# EAGLE design HS(MASTER SHIELD MAX485)V1 (EAGLE 8.3.0)
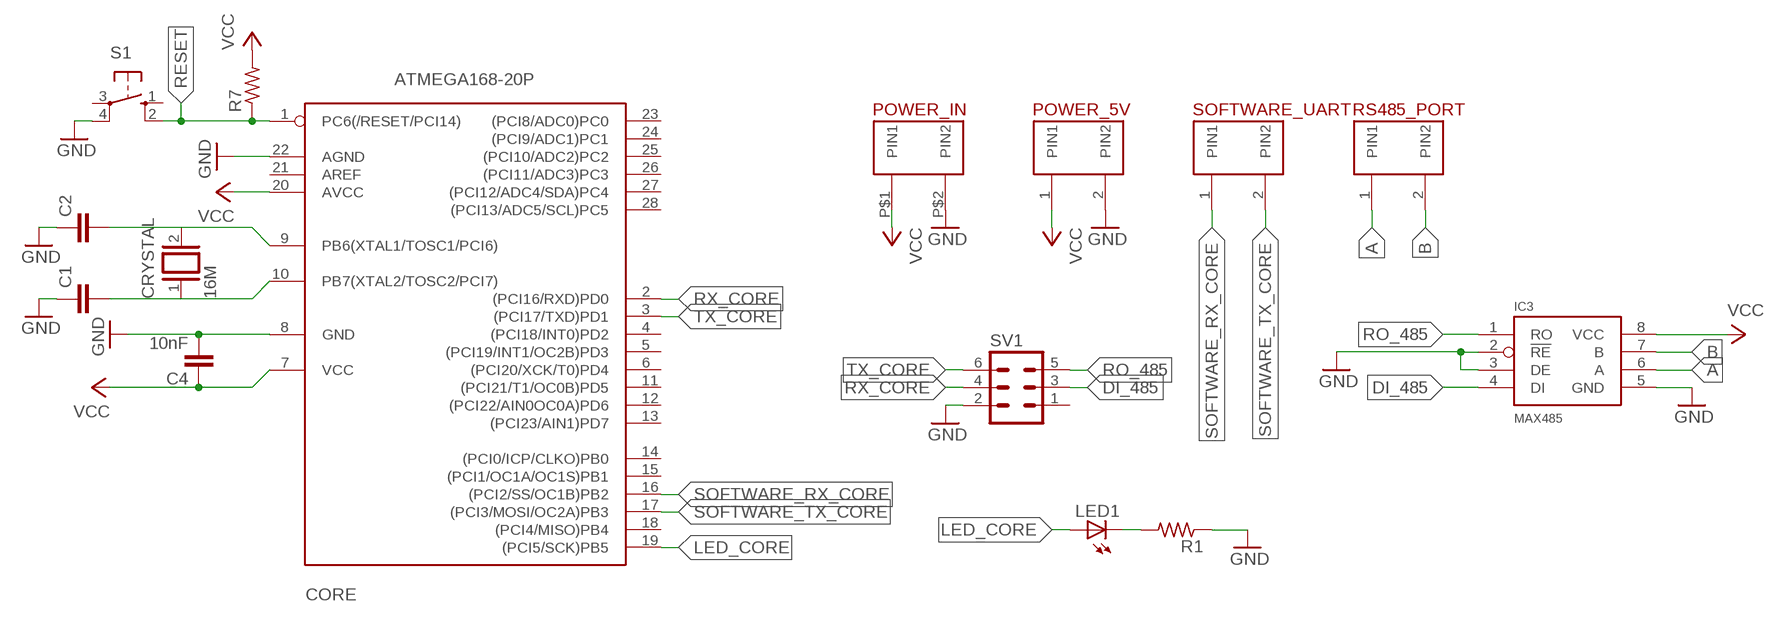
[diagram p0: schematic, sheet 1]

## Parts
C1  C-EU025-024X044  [C025-024X044]
C2  C-EU025-024X044  [C025-024X044]
C4  10nF  C5/2.5  [C5B2.5]
CORE  ATMEGA168-20P  [DIL28-3]
CRYSTAL  16M  XTAL/S  [QS]
IC3  MAX485  [DIP8]
LED1  LED3MM  [LED3MM]
POWER_5V  7325  [2.54MM]
POWER_IN  4396  [4MM]
R1  R-US_0207/10  [0207/10]
R7  R-US_0207/10  [0207/10]
RS485_PORT  7325  [2.54MM]
S1  10-XX  [B3F-10XX]
SOFTWARE_UART  7325  [2.54MM]
SV1  MA03-2  [MA03-2]

## Nets
A: IC3.6(A) RS485_PORT.1(PIN1)
B: IC3.7(B) RS485_PORT.2(PIN2)
DI_485: IC3.4(DI) SV1.3
GND: C1.1 C2.1 C4.2 CORE.8(GND) CORE.22(AGND) IC3.2(!RE) IC3.3(DE) IC3.5(GND) POWER_5V.2(PIN2) POWER_IN.P$2(PIN2) R1.1 S1.4(P1) SV1.2
LED_CORE: CORE.19((PCI5/SCK)PB5) LED1.A
N$1: C2.2 CORE.9(PB6(XTAL1/TOSC1/PCI6)) CRYSTAL.2
N$2: C1.2 CORE.10(PB7(XTAL2/TOSC2/PCI7)) CRYSTAL.1
N$3: LED1.K(C) R1.2
RESET: CORE.1(PC6(/RESET/PCI14)) R7.1 S1.2(S1)
RO_485: IC3.1(RO) SV1.5
RX_CORE: CORE.2((PCI16/RXD)PD0) SV1.4
SOFTWARE_RX_CORE: CORE.16((PCI2/SS/OC1B)PB2) SOFTWARE_UART.1(PIN1)
SOFTWARE_TX_CORE: CORE.17((PCI3/MOSI/OC2A)PB3) SOFTWARE_UART.2(PIN2)
TX_CORE: CORE.3((PCI17/TXD)PD1) SV1.6
VCC: C4.1 CORE.7(VCC) CORE.20(AVCC) IC3.8(VCC) POWER_5V.1(PIN1) POWER_IN.P$1(PIN1) R7.2
Unconnected: CORE.4((PCI18/INT0)PD2) CORE.5((PCI19/INT1/OC2B)PD3) CORE.6((PCI20/XCK/T0)PD4) CORE.11((PCI21/T1/OC0B)PD5) CORE.12((PCI22/AIN0OC0A)PD6) CORE.13((PCI23/AIN1)PD7) CORE.14((PCI0/ICP/CLKO)PB0) CORE.15((PCI1/OC1A/OC1S)PB1) CORE.18((PCI4/MISO)PB4) CORE.21(AREF) CORE.23((PCI8/ADC0)PC0) CORE.24((PCI9/ADC1)PC1) CORE.25((PCI10/ADC2)PC2) CORE.26((PCI11/ADC3)PC3) CORE.27((PCI12/ADC4/SDA)PC4) CORE.28((PCI13/ADC5/SCL)PC5) S1.1(S) S1.3(P) SV1.1

## Library data of the parts
C1 C2 = resistor:C-EU: CAPACITOR, European symbol
C4 = capacitor-wima:C: CAPACITOR naming: grid - package width
CORE = adafruit:ATMEGA168*P: MICROCONTROLLER 16 kBytes FLASH 1 kBytes SRAM 512 Bytes EEPROM USART 8-channel 10 bit ADC
CRYSTAL = special:XTAL/S: CRYSTAL
IC3 = max485:MAX485
LED1 = adafruit:LED: LED OSRAM: - CHIPLED LG R971, LG N971, LY N971, LG Q971, LY Q971, LO R971, LY R971 LH N974, LH R974 LS Q976, LO Q976, LY Q976 LO Q996 - Hyper CHIPLED LW Q18S LB Q993, LB Q99A, LB R99A - SideLED LS A670, LO A670, LY A670, LG A670, LP A670 LB A673, LV A673, LT A673, LW A673 LH A674 LY A675 LS A676, LA A676, LO A676, LY A676, LW A676 LS A679, LY A679, LG A679 - Hyper Micro SIDELED® LS Y876, LA Y876, LO Y876, LY Y876 LT Y87S - SmartLED LW L88C, LW L88S LB L89C, LB L89S, LG L890 LS L89K, LO L89K, LY L89K LS L896, LA L896, LO L896, LY L896 - TOPLED LS T670, LO T670, LY T670, LG T670, LP T670 LSG T670, LSP T670, LSY T670, LOP T670, LYG T670 LG T671, LOG T671, LSG T671 LB T673, LV T673, LT T673, LW T673 LH T674 LS T676, LA T676, LO T676, LY T676, LB T676, LH T676, LSB T676, LW T676 LB T67C, LV T67C, LT T67C, LS T67K, LO T67K, LY T67K, LW E67C LS E67B, LA E67B, LO E67B, LY E67B, LB E67C, LV E67C, LT E67C LW T67C LS T679, LY T679, LG T679 LS T770, LO T770, LY T770, LG T770, LP T770 LB T773, LV T773, LT T773, LW T773 LH T774 LS E675, LA E675, LY E675, LS T675 LS T776, LA T776, LO T776, LY T776, LB T776 LHGB T686 LT T68C, LB T68C - Hyper Mini TOPLED® LB M676 - Mini TOPLED Santana® LG M470 LS M47K, LO M47K, LY M47K Source: http://www.osram.convergy.de/
POWER_5V RS485_PORT SOFTWARE_UART = sonchai:7325
POWER_IN = sonchai:4396
R1 R7 = adafruit:R-US_: RESISTOR, American symbol
S1 = switch-omron:10-XX: OMRON SWITCH; MPN: B3F-1000; OC_FARNELL: 176432; OC_NEWARK: 36M3542
SV1 = con-lstb:MA03-2: PIN HEADER; OC_FARNELL: unknown; OC_NEWARK: unknown

## Net classes
0 default: width 0.15 mm, drill 0.3 mm, clearance 0.15 mm

## Board
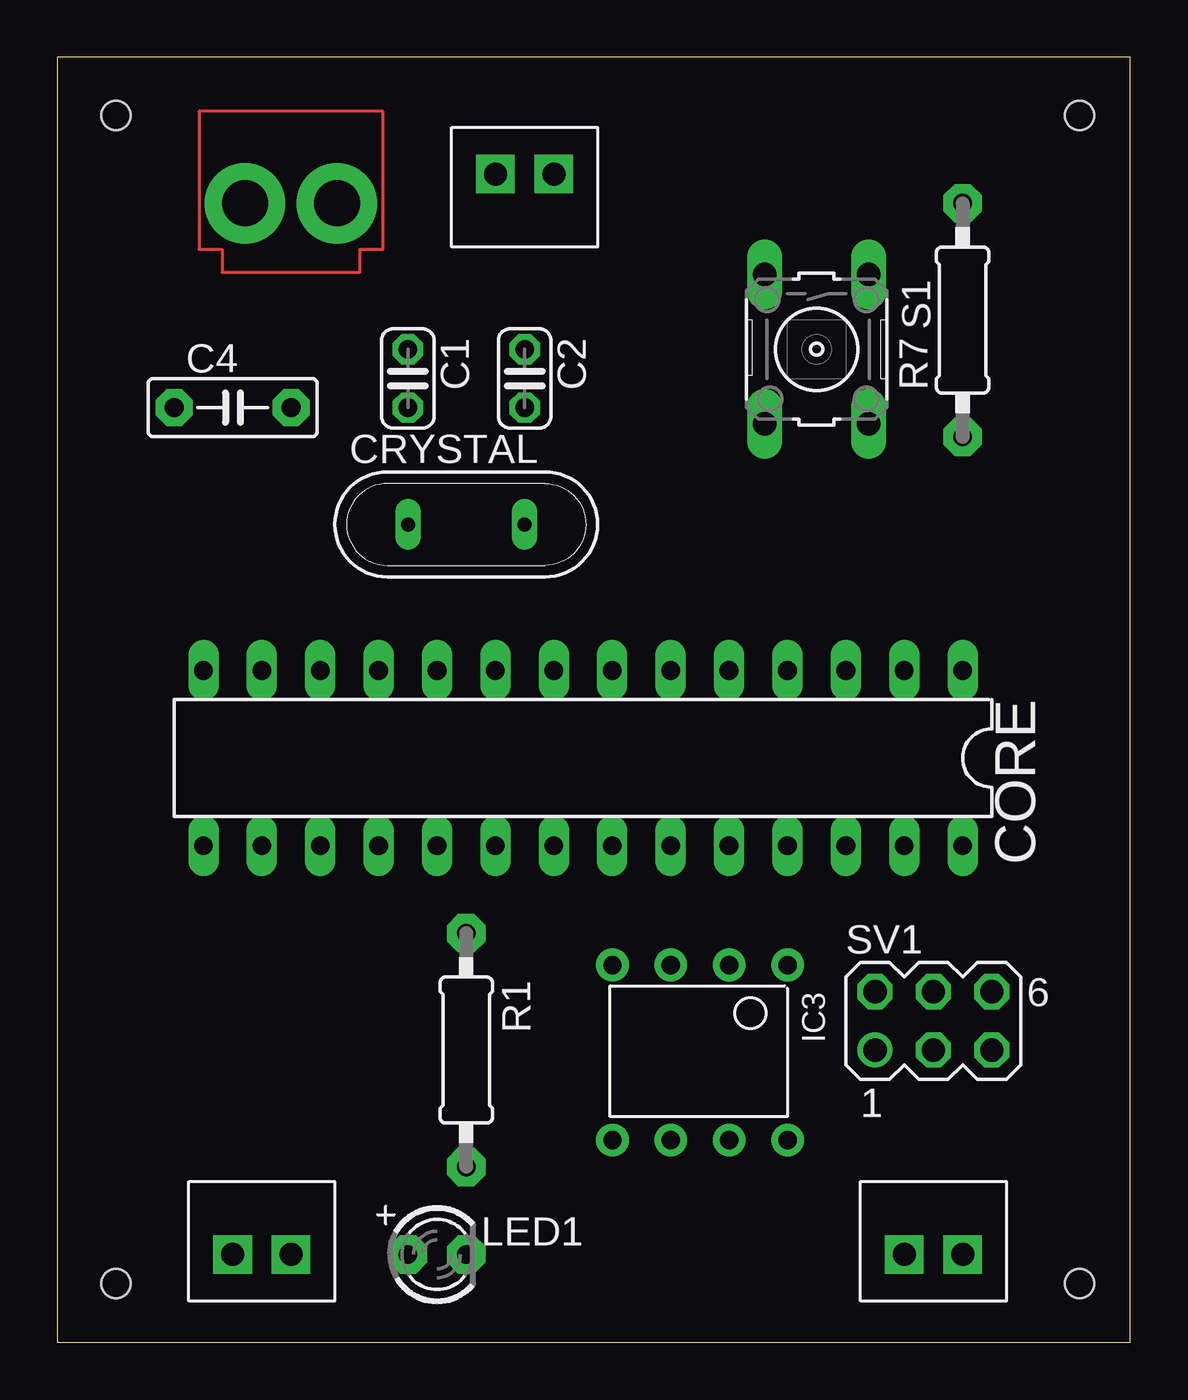
[diagram p1: board, top side]
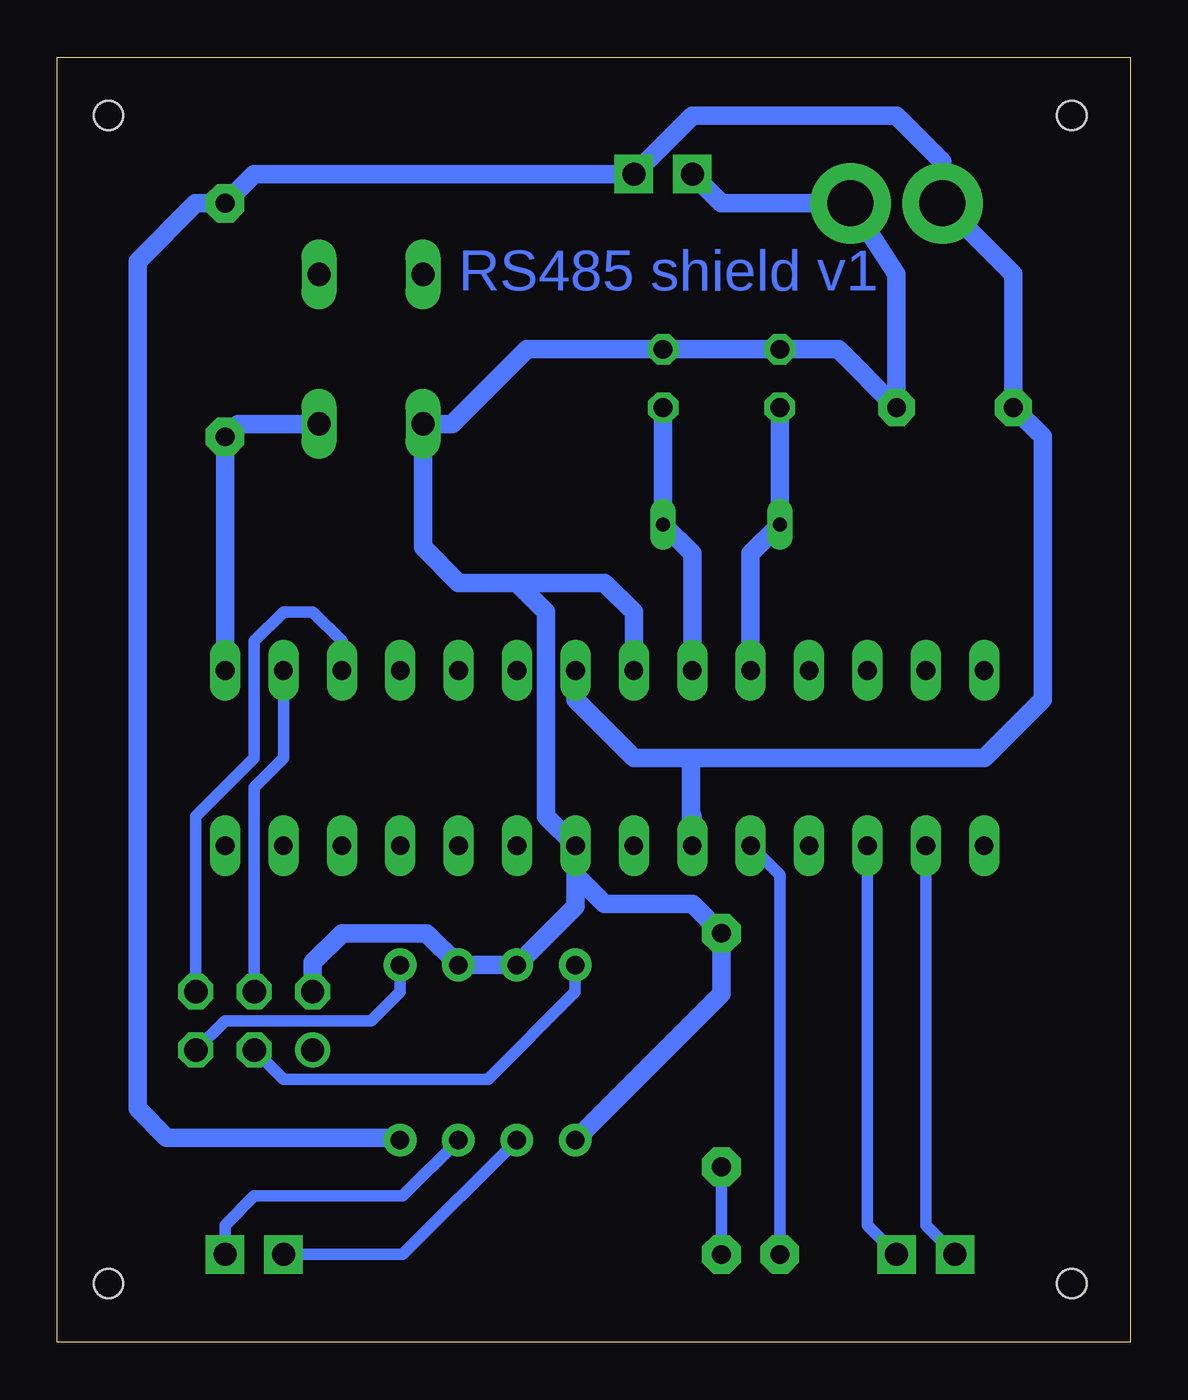
[diagram p2: board, bottom side, seen from below]

Size 46.66 x 55.87 mm. Coordinates in mm from the lower left corner, seen from the top.
Outline: 0,0 46.66,0 46.66,55.87 0,55.87 0,0
Copper layers (1*16): Top 0.035mm / dielectric 1.5mm / Bottom 0.035mm
Design rules "default": minimum track width 6mil, minimum drill 0.35mm, track to track 6mil, track to pad 6mil, pad to pad 6mil, via to via 6mil, smd to smd 6mil, copper to edge 40mil, drill to drill 6mil, minimum pad ring 10mil, minimum via ring 8mil, stop-mask expansion 4mil, vias tented up to drill 0mil, thermal gap 10mil
Holes 1.27 mm at 2.54,53.34 44.45,53.34 44.45,2.54 2.54,2.54

### Footprints (pad centres in the part's own frame; a part is rotated, then mirrored left to right if it is on the bottom)
C025-024X044 = drill 0.813 octagon: 1 -1.27,0; 2 1.27,0
C5B2.5 = drill 0.813 pad 1.6 octagon: 1 -2.54,0; 2 2.54,0
DIL28-3 = drill 0.813 long: 1 -16.51,-3.81; 2 -13.97,-3.81; 3 -11.43,-3.81; 4 -8.89,-3.81; 5 -6.35,-3.81; 6 -3.81,-3.81; 7 -1.27,-3.81; 8 1.27,-3.81; 9 3.81,-3.81; 10 6.35,-3.81; 11 8.89,-3.81; 12 11.43,-3.81; 13 13.97,-3.81; 14 16.51,-3.81; 15 16.51,3.81; 16 13.97,3.81; 17 11.43,3.81; 18 8.89,3.81; 19 6.35,3.81; 20 3.81,3.81; 21 1.27,3.81; 22 -1.27,3.81; 23 -3.81,3.81; 24 -6.35,3.81; 25 -8.89,3.81; 26 -11.43,3.81; 27 -13.97,3.81; 28 -16.51,3.81
QS = drill 0.61 long: 1 -2.54,0; 2 2.54,0
DIP8 = drill 0.8 pad 1.422: 1 -3.7,3.82; 2 -3.7,1.28; 3 -3.7,-1.26; 4 -3.7,-3.8; 5 3.92,-3.8; 6 3.92,-1.26; 7 3.92,1.28; 8 3.92,3.82
LED3MM = drill 0.813 pad 1.676 octagon: A -1.27,0; K 1.27,0
2.54MM = drill 1 pad 1.676 square: 1 -1.27,0; 2 1.27,0
4MM = drill 2 pad 3.5: P$1 -2,0; P$2 2,0
0207/10 = drill 0.813 pad 1.676 octagon: 1 -5.08,0; 2 5.08,0
B3F-10XX = drill 1.016 long: 1 -3.251,2.261; 2 3.251,2.261; 3 -3.251,-2.261; 4 3.251,-2.261
MA03-2 = drill 1.016: 1 -2.54,-1.27 | drill 1.016 octagon: 2 -2.54,1.27; 3 0,-1.27; 4 0,1.27; 5 2.54,-1.27; 6 2.54,1.27

### Placement (x,y rotation side)
C1  15.24,41.91 270 top
C2  20.32,41.91 270 top
C4  7.62,40.64 0 top
CORE  22.86,25.4 180 top
CRYSTAL  17.78,35.56 0 top
IC3  27.94,12.7 270 top
LED1  16.51,3.81 0 top
POWER_5V  20.32,50.8 180 top
POWER_IN  10.16,49.53 0 top
R1  17.78,12.7 270 top
R7  39.37,44.45 90 top
RS485_PORT  38.1,3.81 0 top
S1  33.02,43.18 270 top
SOFTWARE_UART  8.89,3.81 0 top
SV1  38.1,13.97 0 top

### Tracks (layer width: path | path; a pad name or v marks a point on that pad's centre or on a via)
A
  Bottom 0.508: IC3.6 31.65,3.81 RS485_PORT.1
B
  Bottom 0.508: IC3.7 31.65,6.35 38.1,6.35 39.37,5.08 RS485_PORT.2
DI_485
  Bottom 0.508: SV1.3 36.83,11.43 27.94,11.43 24.14,15.23 IC3.4
GND
  Bottom 0.813: POWER_5V.2 17.78,49.53 POWER_IN.P$2 10.16,46.45 C4.2 12.7,43.18 C1.1 C2.1 26.24,43.18 29.49,39.93 S1.4 30.76,34.57 29.21,33.02 26.67,33.02 | 24.13,20.32 22.86,19.05 19.05,19.05 R1.1 17.78,15.14 IC3.5 | 24.13,20.32 CORE.22 25.4,22.86 25.4,31.75 26.67,33.02 | 24.13,20.32 24.13,18.95 IC3.3 IC3.2 30.6,17.78 34.29,17.78 35.56,16.51 SV1.2 | 21.59,30.48 CORE.8 21.59,31.75 22.86,33.02 26.67,33.02
LED_CORE
  Bottom 0.508: CORE.19 15.24,20.32 LED1.A
N$1
  Bottom 0.813: C2.2 CRYSTAL.2 19.05,34.29 CORE.9
N$2
  Bottom 0.813: C1.2 CRYSTAL.1 16.51,34.29 CORE.10
N$3
  Bottom 0.508: LED1.K R1.2
RESET
  Bottom 0.813: S1.2 38.81,39.93 R7.1 CORE.1
RO_485
  Bottom 0.508: SV1.5 39.37,13.97 33.02,13.97 31.76,15.23 IC3.1
RX_CORE
  Bottom 0.508: SV1.4 38.1,24.13 36.83,25.4 CORE.2
SOFTWARE_RX_CORE
  Bottom 0.508: CORE.16 8.89,5.08 SOFTWARE_UART.1
SOFTWARE_TX_CORE
  Bottom 0.508: CORE.17 11.43,5.08 SOFTWARE_UART.2
TX_CORE
  Bottom 0.508: CORE.3 34.29,30.48 35.56,31.75 36.83,31.75 38.1,30.48 38.1,25.4 40.64,22.86 SV1.6
VCC
  Bottom 0.813: IC3.8 31.87,8.89 41.91,8.89 43.18,10.16 43.18,46.99 40.64,49.53 R7.2 38.1,50.8 POWER_5V.1 19.05,53.34 10.16,53.34 8.16,51.34 POWER_IN.P$1 5.08,46.45 C4.1 3.81,39.37 3.81,27.94 6.35,25.4 19.1,25.4 | CORE.7 24.13,27.94 21.59,25.4 19.1,25.4 | 19.05,22.86 CORE.20 19.1,21.64 19.1,25.4

### Text on the board
Bottom: RS485 shield v1